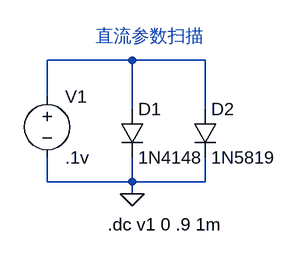
[diagram p0: schematic Draft4.asc]
Draft4.asc, the LTspice schematic file:
Version 4.1
SHEET 1 880 680
WIRE 208 48 96 48
WIRE 304 48 208 48
WIRE 96 96 96 48
WIRE 208 112 208 48
WIRE 304 112 304 48
WIRE 96 208 96 176
WIRE 208 208 208 176
WIRE 208 208 96 208
WIRE 304 208 304 176
WIRE 304 208 208 208
WIRE 208 224 208 208
FLAG 208 224 0
SYMBOL voltage 96 80 R0
SYMATTR InstName V1
SYMATTR Value .1v
SYMBOL diode 192 112 R0
SYMATTR InstName D1
SYMATTR Value 1N4148
SYMBOL diode 288 112 R0
SYMATTR InstName D2
SYMATTR Value 1N5819
SYMATTR Description Diode
SYMATTR Type diode
TEXT 176 264 Left 2 !.dc v1 0 .9 1m
TEXT 160 16 Left 2 ;直流参数扫描

The netlist it stands for:
* Draft4.asc
V1 N001 0 .1v
D1 N001 0 1N4148
D2 N001 0 1N5819
.model D D
.lib standard.dio
.dc v1 0 .9 1m
* 直流参数扫描
.backanno
.end